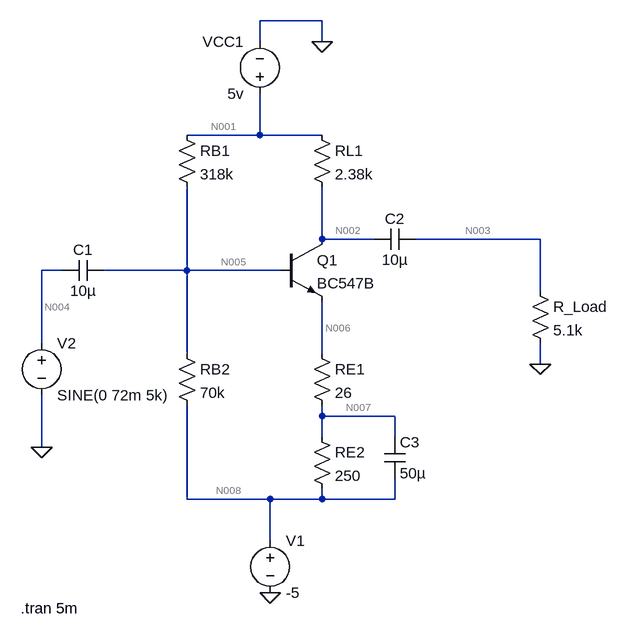
[diagram p0: schematic CE_AMP.asc]
CE_AMP.asc, the LTspice schematic file:
Version 4
SHEET 1 880 1060
WIRE 352 0 256 0
WIRE 256 32 256 0
WIRE 352 32 352 0
WIRE 256 176 256 112
WIRE 256 176 144 176
WIRE 352 176 256 176
WIRE 352 336 352 256
WIRE 432 336 352 336
WIRE 688 336 496 336
WIRE -48 384 -80 384
WIRE 144 384 144 256
WIRE 144 384 16 384
WIRE 288 384 144 384
WIRE 688 416 688 336
WIRE -80 496 -80 384
WIRE 144 512 144 384
WIRE 352 512 352 432
WIRE 688 528 688 496
WIRE 352 608 352 592
WIRE 464 608 352 608
WIRE 352 640 352 608
WIRE 464 640 464 608
WIRE -80 656 -80 576
WIRE 144 736 144 592
WIRE 272 736 144 736
WIRE 352 736 352 720
WIRE 352 736 272 736
WIRE 464 736 464 704
WIRE 464 736 352 736
WIRE 272 800 272 736
FLAG 272 880 0
FLAG 352 32 0
FLAG -80 656 0
FLAG 688 528 0
SYMBOL npn 288 336 R0
SYMATTR InstName Q1
SYMATTR Value BC547B
SYMBOL res 128 160 R0
SYMATTR InstName RB1
SYMATTR Value 318k
SYMBOL res 336 160 R0
SYMATTR InstName RL1
SYMATTR Value 2.38k
SYMBOL res 336 496 R0
SYMATTR InstName RE1
SYMATTR Value 26
SYMBOL res 128 496 R0
SYMATTR InstName RB2
SYMATTR Value 70k
SYMBOL cap 16 368 R90
WINDOW 0 0 32 VBottom 2
WINDOW 3 32 32 VTop 2
SYMATTR InstName C1
SYMATTR Value 10µ
SYMBOL cap 496 320 R90
WINDOW 0 0 32 VBottom 2
WINDOW 3 32 32 VTop 2
SYMATTR InstName C2
SYMATTR Value 10µ
SYMBOL cap 448 640 R0
SYMATTR InstName C3
SYMATTR Value 50µ
SYMBOL res 336 624 R0
SYMATTR InstName RE2
SYMATTR Value 250
SYMBOL voltage 256 128 R180
WINDOW 0 24 96 Left 2
WINDOW 3 24 16 Left 2
WINDOW 123 0 0 Left 0
WINDOW 39 0 0 Left 0
SYMATTR InstName VCC1
SYMATTR Value 5v
SYMBOL voltage 272 784 R0
WINDOW 123 0 0 Left 0
WINDOW 39 0 0 Left 0
SYMATTR InstName V1
SYMATTR Value -5
SYMBOL voltage -80 480 R0
WINDOW 123 0 0 Left 0
WINDOW 39 0 0 Left 0
SYMATTR InstName V2
SYMATTR Value SINE(0 72m 5k)
SYMBOL res 672 400 R0
SYMATTR InstName R_Load
SYMATTR Value 5.1k
TEXT -112 904 Left 2 !.tran 5m

The netlist it stands for:
* CE_AMP.asc
Q1 N002 N005 N006 0 BC547B
RB1 N001 N005 318k
RL1 N001 N002 2.38k
RE1 N006 N007 26
RB2 N005 N008 70k
C1 N005 N004 10µ
C2 N003 N002 10µ
C3 N007 N008 50µ
RE2 N007 N008 250
VCC1 N001 0 5v
V1 N008 0 -5
V2 N004 0 SINE(0 72m 5k)
R_Load N003 0 5.1k
.model NPN NPN
.model PNP PNP
.lib standard.bjt
.tran 5m
.backanno
.end

* Results of the author's LTspice run, read from the files saved beside the schematic
* Operating Point, zero values left out:
*   V(n002) = -753 mV
*   V(n005) = -3.669 V
*   V(n006) = -4.331 V
*   V(n001) = 5 V
*   V(n007) = -4.394 V
*   V(n008) = -5 V
*   Ic(Q1) = 2.417 mA
*   Ib(Q1) = 8.244 µA
*   Ie(Q1) = -2.425 mA
*   I(Rb1) = 27.26 µA
*   I(Rl1) = 2.417 mA
*   I(Re1) = 2.425 mA
*   I(Rb2) = 19.02 µA
*   I(Re2) = 2.425 mA
*   I(Vcc1) = -2.444 mA
*   I(V1) = 2.444 mA
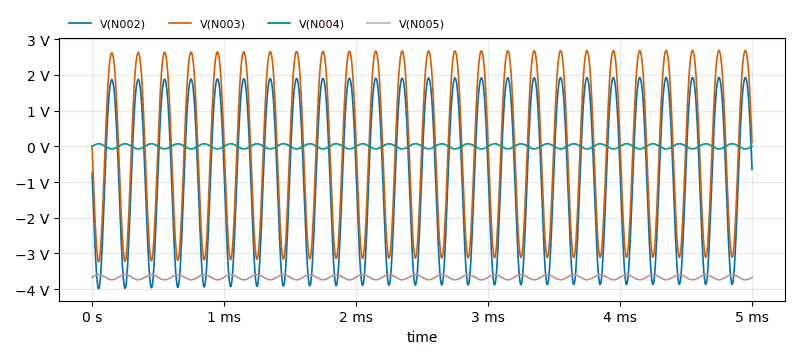
[diagram p1: Transient Analysis of CE_AMP.asc, plotted from the saved traces]
* Transient Analysis, 1 run:
*   V(N002): min -3.993 V, max 1.93 V, average -812.2 mV, rms 2.231 V, last -646.8 mV
*   V(N003): min -3.238 V, max 2.69 V, average -53.98 mV, rms 2.079 V, last 111.5 mV
*   V(N004): min -71.99 mV, max 72 mV, average 4.331 µV, rms 50.92 mV, last 0 V
*   V(N005): min -3.741 V, max -3.597 V, average -3.669 V, rms 3.669 V, last -3.669 V